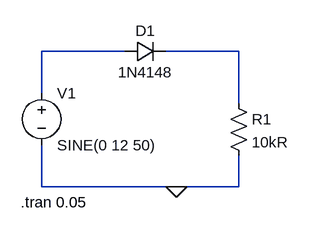
[diagram p0: schematic half_wave_rectifier.asc]
half_wave_rectifier.asc, the LTspice schematic file:
Version 4
SHEET 1 880 680
WIRE 160 80 32 80
WIRE 336 80 224 80
WIRE 32 144 32 80
WIRE 336 160 336 80
WIRE 32 288 32 224
WIRE 240 288 32 288
WIRE 336 288 336 240
WIRE 336 288 240 288
FLAG 240 288 0
SYMBOL voltage 32 128 R0
WINDOW 123 0 0 Left 0
WINDOW 39 0 0 Left 0
SYMATTR InstName V1
SYMATTR Value SINE(0 12 50)
SYMBOL diode 160 96 R270
WINDOW 0 32 32 VTop 2
WINDOW 3 0 32 VBottom 2
SYMATTR InstName D1
SYMATTR Value 1N4148
SYMBOL res 320 144 R0
SYMATTR InstName R1
SYMATTR Value 10kR
TEXT 0 312 Left 2 !.tran 0.05

The netlist it stands for:
* half_wave_rectifier.asc
V1 N001 0 SINE(0 12 50)
D1 N001 N002 1N4148
R1 N002 0 10kR
.model D D
.lib standard.dio
.tran 0.05
.backanno
.end